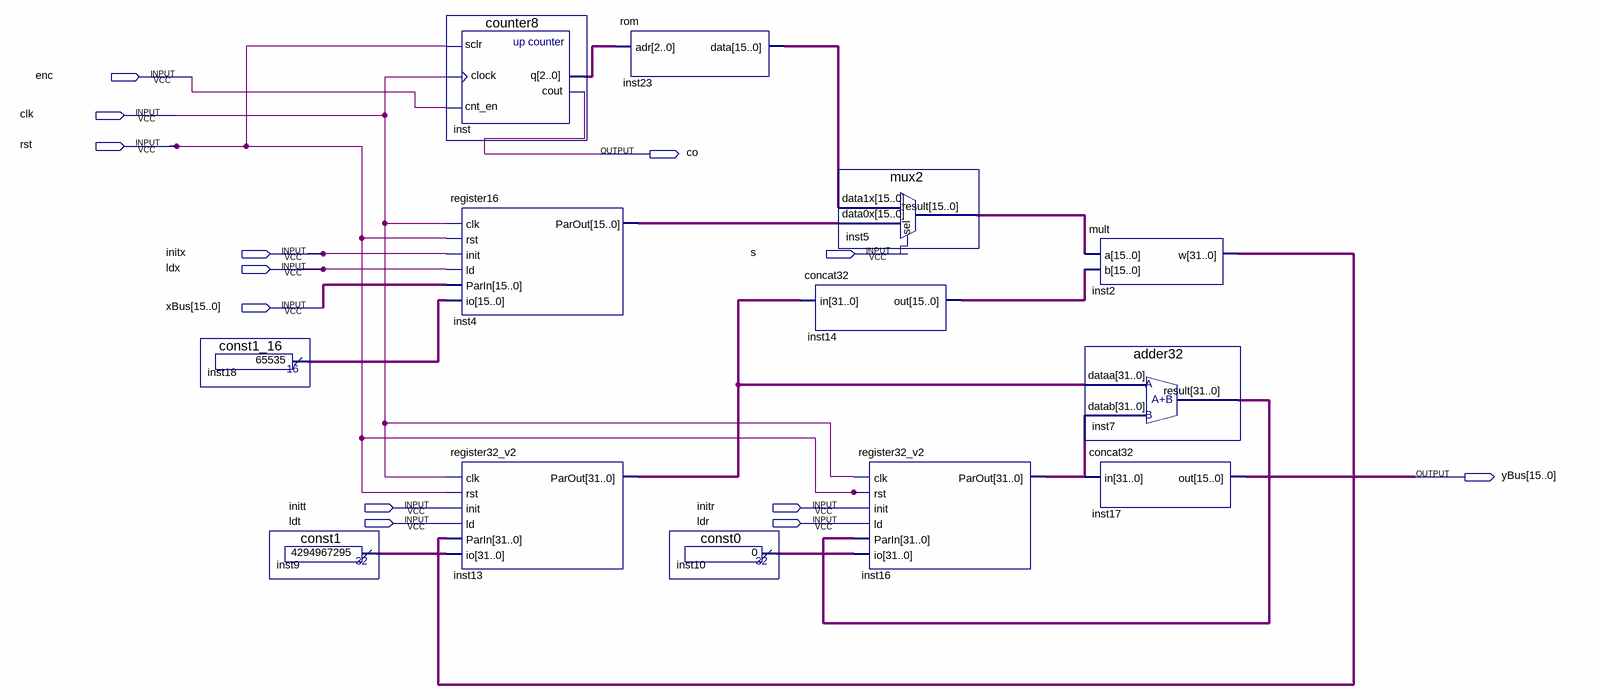
[diagram p0: schematic sheet]
// Quartus schematic ca6.bdf as structural Verilog: 13 symbols, 13 pins
module ca6 (
  input  enc,
  input  clk,
  input  rst,
  input  initx,
  input  s,
  input  ldx,
  input  [15:0] xBus,
  input  initt,
  input  initr,
  input  ldt,
  input  ldr,
  output co,
  output [15:0] yBus
);

  wire [2:0] inst_q;
  wire [15:0] inst4_parout, inst5_result, inst14_out, inst18_result, inst23_data;
  wire [31:0] inst2_w, inst7_result, inst9_result, inst10_result, inst13_parout, inst16_parout;

  const1_16 inst18 (.result(inst18_result));
  const1 inst9 (.result(inst9_result));
  counter8 inst (.sclr(rst), .clock(clk), .cnt_en(enc), .cout(co), .q(inst_q));
  register16 inst4 (
    .clk(clk), .rst(rst), .init(initx), .ld(ldx), .ParIn(xBus), .io(inst18_result), .ParOut(inst4_parout));
  register32_v2 inst13 (
    .clk(clk), .rst(rst), .init(initt), .ld(ldt), .ParIn(inst2_w), .io(inst9_result), .ParOut(inst13_parout));
  rom inst23 (.adr(inst_q), .data(inst23_data));
  const0 inst10 (.result(inst10_result));
  concat32 inst14 (.in(inst13_parout), .out(inst14_out));
  mux2 inst5 (.data1x(inst23_data), .data0x(inst4_parout), .sel(s), .result(inst5_result));
  register32_v2 inst16 (
    .clk(clk), .rst(rst), .init(initr), .ld(ldr), .ParIn(inst7_result), .io(inst10_result),
    .ParOut(inst16_parout));
  mult inst2 (.a(inst5_result), .b(inst14_out), .w(inst2_w));
  adder32 inst7 (.dataa(inst13_parout), .datab(inst16_parout), .result(inst7_result));
  concat32 inst17 (.in(inst16_parout), .out(yBus));
endmodule
